# Altium schematic sheet ДЗ.SchDoc
size 594 x 420 mm; SheetNumber: 1; SheetTotal: 1
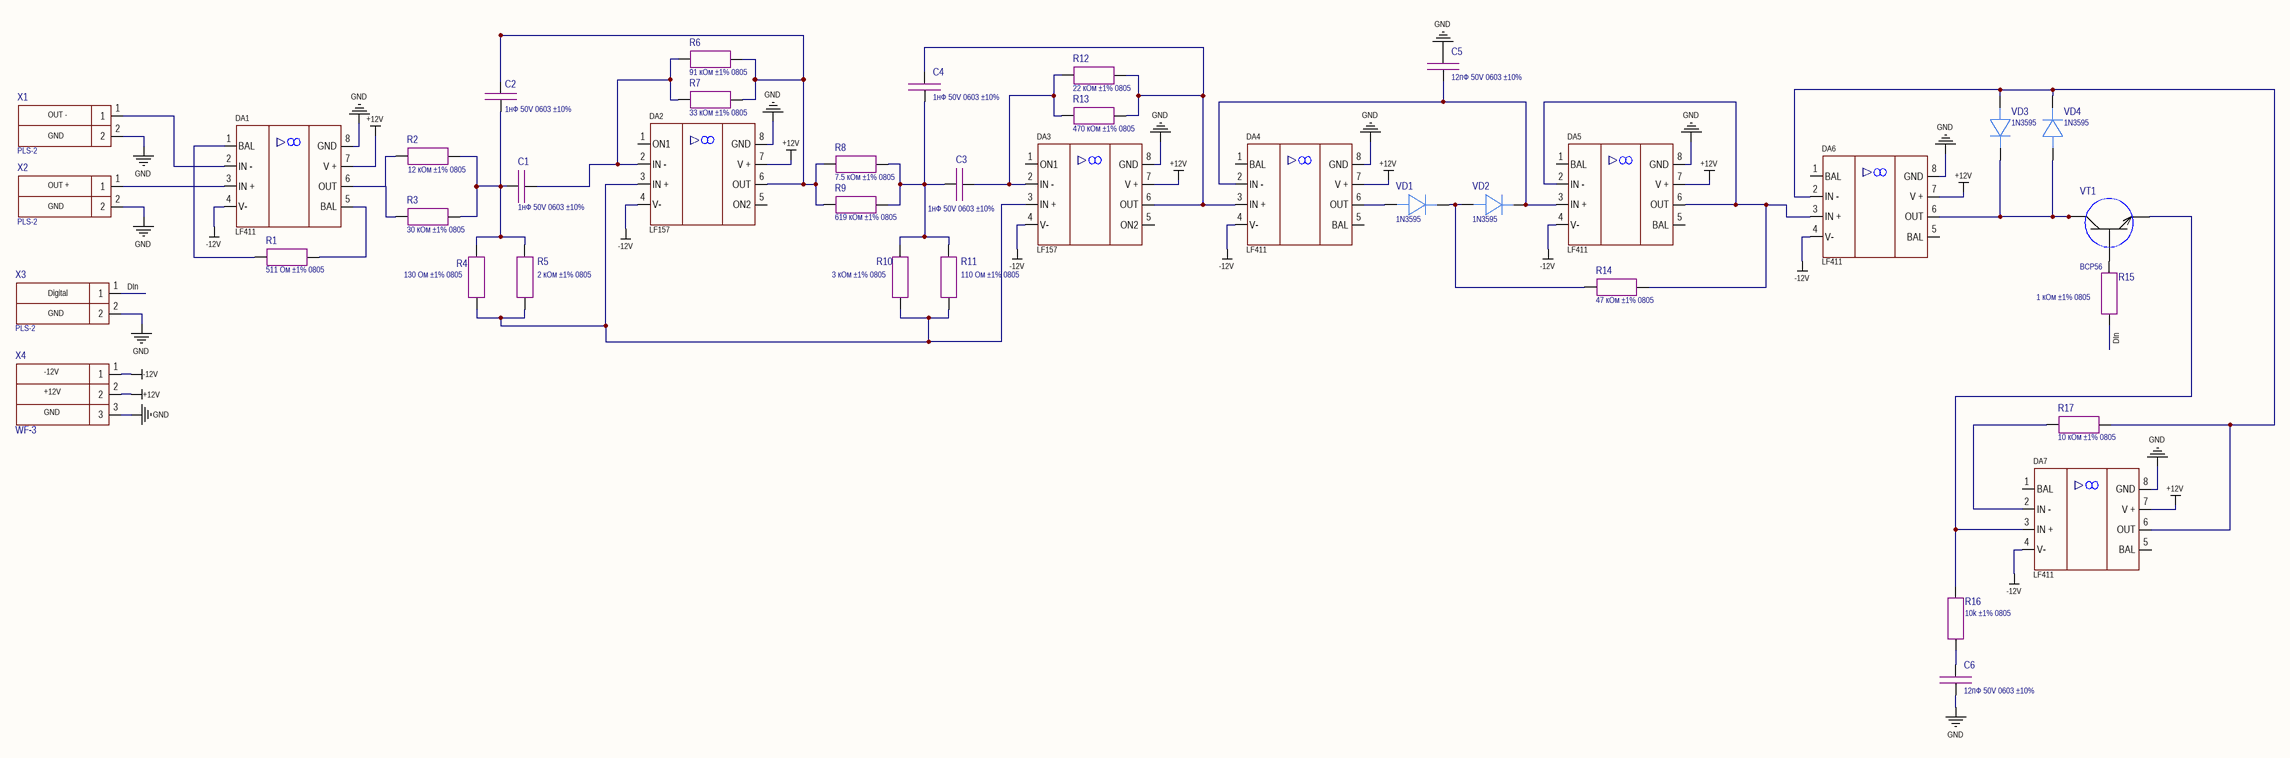
[diagram p0: ДЗ.SchDoc]

## Parts
C1  1нФ 50V 0603 ±10%  [CAP: SMD 0603 MD IPC 782]
C2  1нФ 50V 0603 ±10%  [CAP: SMD 0603 MD IPC 782]
C3  1нФ 50V 0603 ±10%  [CAP: SMD 0603 MD IPC 782]
C4  1нФ 50V 0603 ±10%  [CAP: SMD 0603 MD IPC 782]
C5  12пФ 50V 0603 ±10%  [CAP: SMD 0603 MD IPC 782]
C6  12пФ 50V 0603 ±10%  [CAP: SMD 0603 MD IPC 782]
DA1  LF411  [IC: PDIP-8]
DA2  LF157  [IC: SOIC 8]
DA3  LF157  [IC: SOIC 8]
DA4  LF411  [IC: PDIP-8]
DA5  LF411  [IC: PDIP-8]
DA6  LF411  [IC: PDIP-8]
DA7  LF411  [IC: PDIP-8]
R1  511 Ом ±1% 0805  [RES: SMD 0805 MD IPC 782]
R2  12 кОм ±1% 0805  [RES: SMD 0805 MD IPC 782]
R3  30 кОм ±1% 0805  [RES: SMD 0805 MD IPC 782]
R4  130 Ом ±1% 0805  [RES: SMD 0805 MD IPC 782]
R5  2 кОм ±1% 0805  [RES: SMD 0805 MD IPC 782]
R6  91 кОм ±1% 0805  [RES: SMD 0805 MD IPC 782]
R7  33 кОм ±1% 0805  [RES: SMD 0805 MD IPC 782]
R8  7.5 кОм ±1% 0805  [RES: SMD 0805 MD IPC 782]
R9  619 кОм ±1% 0805  [RES: SMD 0805 MD IPC 782]
R10  3 кОм ±1% 0805  [RES: SMD 0805 MD IPC 782]
R11  110 Ом ±1% 0805  [RES: SMD 0805 MD IPC 782]
R12  22 кОм ±1% 0805  [RES: SMD 0805 MD IPC 782]
R13  470 кОм ±1% 0805  [RES: SMD 0805 MD IPC 782]
R14  47 кОм ±1% 0805  [RES: SMD 0805 MD IPC 782]
R15  1 кОм ±1% 0805  [RES: SMD 0805 MD IPC 782]
R16  10k ±1% 0805  [RES: SMD 0805 MD IPC 782]
R17  10 кОм ±1% 0805  [RES: SMD 0805 MD IPC 782]
VD1  1N3595  [DIODE: SMB]
VD2  1N3595  [DIODE: SMB]
VD3  1N3595  [DIODE: SMB]
VD4  1N3595  [DIODE: SMB]
VT1  BCP56  [IC: SOT 223]
X1  PLS-2  [CON: 2PIN PLS 2]
X2  PLS-2  [CON: 2PIN PLS 2]
X3  PLS-2  [CON: 2PIN PLS 2]
X4  WF-3  [CON: 3pin wf-3]

## Nets
+12V: DA1.7(V_+) DA2.7(V_+) DA3.7(V_+) DA4.7(V_+) DA5.7(V_+) DA6.7(V_+) DA7.7(V_+) X4.2
-12V: DA1.4(V-) DA2.4(V-) DA3.4(V-) DA4.4(V-) DA5.4(V-) DA6.4(V-) DA7.4(V-) X4.1
GND: C5.2 C6.1 DA1.8(GND) DA2.8(GND) DA3.8(GND) DA4.8(GND) DA5.8(GND) DA6.8(GND) DA7.8(GND) X1.2 X2.2 X3.2 X4.3
DIn: R15.2 X3.1
NetC1_1: C1.1 DA2.2(IN_-) R6.1 R7.1
NetC1_2: C1.2 C2.2 R2.2 R3.2 R4.2 R5.2
NetC2_1: C2.1 DA2.6(OUT) R6.2 R7.2 R8.1 R9.1
NetC3_1: C3.1 DA3.2(IN_-) R12.1 R13.1
NetC3_2: C3.2 C4.1 R8.2 R9.2 R10.2 R11.2
NetC4_2: C4.2 DA3.6(OUT) DA4.3(IN_+) R12.2 R13.2
NetC5_1: C5.1 DA4.2(IN_-) DA5.3(IN_+) VD2.1
NetC6_2: C6.2 R16.2
NetDA1_1: DA1.1(BAL) R1.1
NetDA1_2: DA1.2(IN_-) X1.1
NetDA1_3: DA1.3(IN_+) X2.1
NetDA1_5: DA1.5(BAL) R1.2
NetDA1_6: DA1.6(OUT) R2.1 R3.1
NetDA2_3: DA2.3(IN_+) DA3.3(IN_+) R4.1 R5.1 R10.1 R11.1
NetDA4_6: DA4.6(OUT) VD1.2
NetDA5_2: DA5.2(IN_-) DA5.6(OUT) DA6.3(IN_+) R14.2
NetDA6_2: DA6.2(IN_-) DA7.6(OUT) R17.2 VD3.2 VD4.1
NetDA6_6: DA6.6(OUT) VD3.1 VD4.2 VT1.2 VT1.4
NetDA7_2: DA7.2(IN_-) R17.1
NetDA7_3: DA7.3(IN_+) R16.1 VT1.3
NetR14_1: R14.1 VD1.1 VD2.2
NetR15_1: R15.1 VT1.1

Not connected (* = marked no-connect by the designer): DA2 1(ON1) 5(ON2); DA3 1(ON1) 5(ON2); DA4 1(BAL) 5(BAL); DA5 1(BAL) 5(BAL); DA6 1(BAL) 5(BAL); DA7 1(BAL) 5(BAL)

## Notes on the sheet
- (near X1) OUT -
- GND
- OUT +
- (near X3) Digital
- +12V
- -12V
- Перв. примен.
- Справ. №
- Подп. и дата
- Инв. № дубл.
- Взам. инв. №
- Разраб.
- Изм.
- Лист
- № докум.
- Подп.
- Дата
- Лит.
- Масса
- Масштаб
- Пров.
- Т.контр.
- Листов
- Инв. № подл.
- Утв.
- Н.контр.
- 2.106-A2
- Копировал
- Формат А2

## Library data of the parts
C1-C6 = 47p 50V 0603 ±10%: Code: 6279259841; Name: Конденсатор X7R 50V 0,047uF +-10% 0603
R1 = 510 ±1% 0805: Code: 6069137191; Name: Резистор 510R±1%  0805
R2 = 15k ±1% 0805: Code: 6027162091; Name: Резистор RT0805FRE1015KL, Yageo
R3 = 20k ±1% 0805: Code: 6094357581; Name: Резистор 20K±1% 0805
R4 R5 R10 R11 = 100k ±1% 0805: Code: 6094357811; Name: Резистор 100K±1% 0805
R6-R9 R12-R15 R17 = 2k ±1% 0805: Code: 6094352561; Name: Резистор 2k±1%  0805
R16 = 10k ±1% 0805: Code: 6020003061; Name: Резистор RC0805JR-0710KL
VD1-VD4 = Rectifier 1A 40V: Code: 6349982351; Name: Диод VS-10BQ040-M35BT, Vishay
VT1 = BJT NPN BCP56: Code: 6341295616; Name: Транзистор BCP56-16 ITC, Infinion
X1-X3 = 2 pin PLS 2: Code: 6313952321; Name: Вилка PLS-2
X4 = 3 pin WF-3: Code: 6313932013; Name: Вилка WF-3